# Altium project lora_carrier.PrjPcb
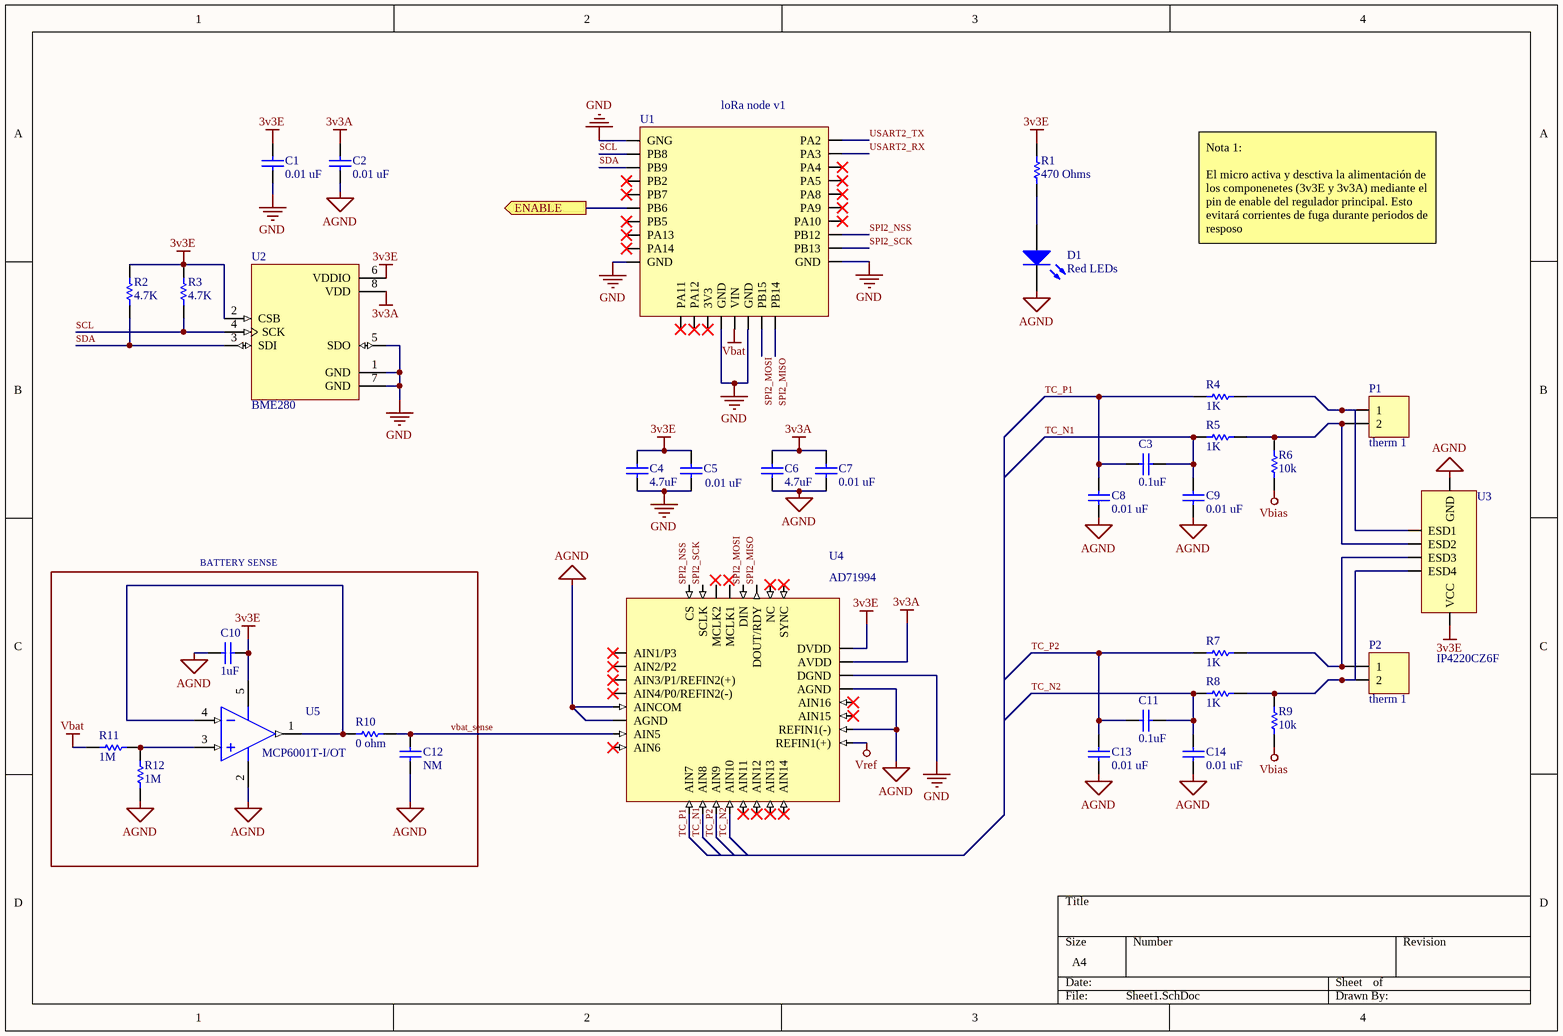
[diagram p0: Sheet1.SchDoc]
2 sheets, 50 parts. Net scope: flat (ports and power ports of the same name join across sheets).
Sheets:
  Sheet1.SchDoc
  supply.SchDoc

## Sheet Sheet1.SchDoc
size A4

### Parts
C1  0.01 uF
C2  0.01 uF
C3  0.1uF  [Chip2PinKEMETcap]
C4  4.7uF
C5  0.01 uF
C6  4.7uF
C7  0.01 uF
C8  0.01 uF
C9  0.01 uF
C10  1uF  [Chip2PinWURTcap]
C11  0.1uF  [Chip2PinKEMETcap]
C12  NM
C13  0.01 uF
C14  0.01 uF
D1  Red LEDs  [Wurth_LED_0603]
P1  therm 1  [HDR1X2]
P2  therm 1  [HDR1X2]
R1  470 Ohms
R2  4.7K
R3  4.7K
R4  1K
R5  1K
R6  10k
R7  1K
R8  1K
R9  10k
R10  0 ohm
R11  1M
R12  1M
U1  loRa node v1
U2  BME280
U3  IP4220CZ6F
U4  AD71994
U5  MCP6001T-I/OT

### Blocks framed on the sheet
BATTERY SENSE: C10 C12 R10-R12 U5

### Ports
ENABLE (out)

### Nets
3v3A: C2.1 C6.2 C7.1 U2.8(VDD) U4.23(AVDD)
3v3E: C1.1 C4.2 C5.1 C10.2 R1.1 R2.2 R3.2 U2.2(CSB) U2.6(VDDIO) U3.5(VCC) U4.24(DVDD) U5.5(V+)
AGND: C1.2 C2.2 C4.1 C5.2 C6.1 C7.2 C8.2 C9.1 C10.1 C12.2 C13.2 C14.1 D1.2(K) R12.1 U1.1(GNG) U1.10(GND) U1.14(GND) U1.16(GND) U1.19(GND) U2.1(GND) U2.5(SDO) U2.7(GND) U3.2(GND) U4.5(AINCOM) U4.6(AGND) U4.18(REFIN1(-)) U4.21(AGND) U4.22(DGND) U5.2(V-)  [also labelled GND]
Vbat: R11.1 U1.15(VIN)
Vbias: R6.2 R9.2
Vref: U4.17(REFIN1(+))
SCL: R3.1 U1.2(PB8) U2.4(SCK)
SDA: R2.1 U1.3(PB9) U2.3(SDI)
SPI2_MISO: U1.18(PB14) U4.27(DOUT/RDY)
SPI2_MOSI: U1.17(PB15) U4.28(DIN)
SPI2_NSS: U1.21(PB12) U4.32(CS)
SPI2_SCK: U1.20(PB13) U4.31(SCLK)
TC_N1: C3.2 C9.2 R5.1 U4.10(AIN8)
TC_N2: C11.2 C14.2 R8.1 U4.12(AIN10)
TC_P1: C3.1 C8.1 R4.1 U4.9(AIN7)
TC_P2: C11.1 C13.1 R7.1 U4.11(AIN9)
USART2_RX: U1.27(PA3)
USART2_TX: U1.28(PA2)
vbat_sense: C12.1 R10.2 U4.7(AIN5)
NetD1_1: D1.1(A) R1.2
NetP1_1: P1.1 R4.2 U3.1(ESD1)
NetP1_2: P1.2 R5.2 R6.1 U3.3(ESD2)
NetP2_1: P2.1 R7.2 U3.4(ESD3)
NetP2_2: P2.2 R8.2 R9.1 U3.6(ESD4)
NetR10_1: R10.1 U5.1(OUT) U5.4(IN-)
NetR11_2: R11.2 R12.2 U5.3(IN+)
NetU1_6: U1.6(PB6) ; port ENABLE

Not connected (* = marked no-connect by the designer): U1 4(PB2)* 5(PB7)* 7(PB5)* 8(PA13)* 9(PA14)* 11(PA11)* 12(PA12)* 13(3V3)* 22(PA10)* 23(PA9)* 24(PA8)* 25(PA5)* 26(PA4)*; U4 1(AIN1/P3)* 2(AIN2/P2)* 3(AIN3/P1/REFIN2(+))* 4(AIN4/P0/REFIN2(-))* 8(AIN6)* 13(AIN11)* 14(AIN12)* 15(AIN13)* 16(AIN14)* 19(AIN15)* 20(AIN16)* 25(SYNC)* 26(NC)* 29(MCLK1) 30(MCLK2)

### Notes on the sheet
- Nota 1:
  El micro activa y desctiva la alimentación de los componenetes (3v3E y 3v3A) mediante el pin de enable del regulador principal. Esto evitará corrientes de fuga durante periodos de resposo

### Library data of the parts
C1 C2 C5 C7-C9 C13 C14 = 885012206089: Multilayer Ceramic Capacitors MLCC - SMD/SMT WCAP-CSGP 0.01uF 0603 10% 50V MLCC; Manufacturer: Wurth Electronics; Voltage Rating DC: 50 VDC; Capacitance - nF: 10 nF; Capacitance - pF: 10000 pF; Dielectric: X7R; Supplier 1: Mouser; Manufacturer Part Number: 885012206089; RoHS: RoHS Compliant; Category: Multilayer Ceramic Capacitors MLCC - SMD/SMT; Stock 1: 174725; Pricing 1: 1=0.040, 10=0.032, 50=0.026, 100=0.021, 250=0.018, 500=0.017, 4000=0.017 (EUR); Capacitance: 0.01 uF; Height: 0.8 mm; Length: 1.6 mm; Package / Case: 0603 (1608 metric); Packaging: Cut Tape; Product: General Type MLCCs; Series: WCAP-CSGP; Termination Style: SMD/SMT; Tolerance: 10 %; Width: 0.8 mm; Brand: Wurth Electronics; Case Code - in: 0603; Case Code - mm: 1608; Maximum Operating Temperature: + 125 C; Minimum Operating Temperature: - 55 C; Product Type: Ceramic Capacitors; Standard Pack Qty: 4000; Subcategory: Capacitors; RoHS - Mouser: Y; Minimum Order Quantity: 1; Reeling: True; ComponentLink1URL: https://www.mouser.com/datasheet/2/445/885012206089-554597.pdf; ComponentLink1Description: https://www.mouser.com/datasheet/2/445/885012206089-554597.pdf; Supplier Part Number 1: 710-885012206089
C3 C11 = C0603C104J3RAC: Multilayer Ceramic Capacitors MLCC - SMD/SMT 25V 0.1uF 0603 X7R 0.05; Manufacturer: KEMET; Tolerance: 5 %; Voltage Rating DC: 25 VDC; Capacitance - nF: 100 nF; Capacitance - pF: 100000 pF; Class: Class 2; CNHTS: 8532241000; TARIC: 8532240000; Published: 8-Jun-2000; LatestRevisionDate: 17-Jul-2002; LatestRevisionNote: Re-released for DXP Platform.; PackageReference: RAD-0.3; Publisher: Altium Limited; PackageDescription: Radial Cap, Thru-Hole; 2 Leads; 0.3 in Pin Spacing; Supplier 1: Mouser; Supplier Part Number 1: 80-C0603C104J3RAC; Manufacturer Part Number: C0603C104J3RAC; RoHS: RoHS Compliant; Category: Multilayer Ceramic Capacitors MLCC - SMD/SMT; Stock 1: 3422; Pricing 1: 1=0.367, 10=0.213, 100=0.129, 500=0.117, 1000=0.106, 4000=0.079, 8000=0.072, 24000=0.069, 48000=0.061 (EUR); Capacitance: 0.1 uF; Height: 0.8 mm; Length: 1.6 mm; Package / Case: 0603 (1608 metric); Packaging: Cut Tape; Product: General Type MLCCs; Series: SMD Comm X7R; Termination Style: SMD/SMT; Voltage Rating AC: -; Width: 0.8 mm; Brand: KEMET; Case Code - in: 0603; Case Code - mm: 1608; Dielectric: X7R; HTS Code: 8532240020; Maximum Operating Temperature: + 125 C; Minimum Operating Temperature: - 55 C; Product Type: Ceramic Capacitors; Standard Pack Qty: 4000; Subcategory: Capacitors; Termination: Standard; RoHS - Mouser: Y; Minimum Order Quantity: 1; Reeling: True; ComponentLink1URL: http://www.mouser.com/datasheet/2/212/KEM_C1002_X7R_SMD-1102033.pdf; ComponentLink1Description: http://www.mouser.com/datasheet/2/212/KEM_C1002_X7R_SMD-1102033.pdf; Value: 0.1uF
C4 C6 = JMK107BJ475KA-T: Multilayer Ceramic Capacitors MLCC - SMD/SMT 4.7uF 6.3V X5R 0603+/-10% Gen Purp; Manufacturer: Taiyo Yuden; Tolerance: 10 %; Type: General Purpose; Voltage Rating DC: 6.3 VDC; Capacitance - nF: 4700 nF; Class: Class 2; Supplier 1: Mouser; Manufacturer Part Number: JMK107BJ475KA-T; RoHS: RoHS Compliant; Category: Multilayer Ceramic Capacitors MLCC - SMD/SMT; Stock 1: 0; Pricing 1: 1=0.114, 10=0.042, 100=0.029, 500=0.024, 1000=0.019, 4000=0.019, 8000=0.014, 12000=0.012 (EUR); Capacitance: 4.7 uF; Height: 0.8 mm; Length: 1.6 mm; Package / Case: 0603 (1608 metric); Packaging: Cut Tape; Product: General Type MLCCs; Series: M; Termination Style: SMD/SMT; Width: 0.8 mm; Brand: Taiyo Yuden; Case Code - in: 0603; Case Code - mm: 1608; Dielectric: X5R; Maximum Operating Temperature: + 85 C; Minimum Operating Temperature: - 55 C; Product Type: Ceramic Capacitors; Standard Pack Qty: 4000; Subcategory: Capacitors; Termination: Standard; RoHS - Mouser: Y; Minimum Order Quantity: 1; Reeling: True; ComponentLink1URL: https://www.mouser.com/datasheet/2/396/mlcc02_e-1307760.pdf; ComponentLink1Description: https://www.mouser.com/datasheet/2/396/mlcc02_e-1307760.pdf; Supplier Part Number 1: 963-JMK107BJ475KA-T
C10 = 885012206052: Ceramic Capacitors; Manufacturer: Wurth Electronics; Tolerance: 10 %; Voltage Rating DC: 16 VDC; Capacitance - nF: 1000 nF; CNHTS: 8532241000; Dielectric: X7R; TARIC: 8532240000; Published: 8-Jun-2000; LatestRevisionDate: 17-Jul-2002; LatestRevisionNote: Re-released for DXP Platform.; PackageReference: RAD-0.3; Publisher: Altium Limited; PackageDescription: Radial Cap, Thru-Hole; 2 Leads; 0.3 in Pin Spacing; Supplier 1: Mouser; Supplier Part Number 1: 710-885012206052; Manufacturer Part Number: 885012206052; RoHS: RoHS Compliant; Category: Multilayer Ceramic Capacitors MLCC - SMD/SMT; Stock 1: 27157; Pricing 1: 1=0.110, 10=0.104, 50=0.085, 100=0.067, 250=0.059, 500=0.054, 4000=0.054 (EUR); Capacitance: 1 uF; Height: 0.8 mm; Length: 1.6 mm; Package / Case: 0603 (1608 metric); Packaging: Cut Tape; Product: General Type MLCCs; Series: WCAP-CSGP; Termination Style: SMD/SMT; Width: 0.8 mm; Brand: Wurth Electronics; Case Code - in: 0603; Case Code - mm: 1608; HTS Code: 8532240020; Maximum Operating Temperature: + 125 C; Minimum Operating Temperature: - 55 C; Product Type: Ceramic Capacitors; Standard Pack Qty: 4000; Subcategory: Capacitors; RoHS - Mouser: Y; Minimum Order Quantity: 1; Reeling: True; ComponentLink1URL: http://www.mouser.com/datasheet/2/445/885012206052-554330.pdf; ComponentLink1Description: http://www.mouser.com/datasheet/2/445/885012206052-554330.pdf
C12 = 0603_CAP
D1 = 150060RS75000: Typical INFRARED GaAs LED; Manufacturer: Wurth Electronics; Lens Color/Style: Water Clear; Power Rating: 72 mW; Lens Shape: Rectangular; Luminous Intensity: 250 mcd; Peak Wavelength: 630 nm; Viewing Angle: 140 deg; CNHTS: 8541401000; If - Forward Current: 20 mA; MXHTS: 85414001; Vf - Forward Voltage: 2 V; Vr - Reverse Voltage: 5 V; Wavelength/Color Temperature: 625 nm; Published: 8-Jun-2000; LatestRevisionDate: 08-Jul-2005; LatestRevisionNote: Mech Layer 1 removed.; PackageReference: LED-0; Publisher: Altium Limited; PackageDescription: LED; 2 Leads; Supplier 1: Mouser; Supplier Part Number 1: 710-150060RS75000; Manufacturer Part Number: 150060RS75000; RoHS: RoHS Compliant; Category: Standard LEDs - SMD; Stock 1: 74254; Pricing 1: 1=0.130, 10=0.126, 50=0.115, 100=0.099, 500=0.085, 4000=0.085 (EUR); Height: 0.7 mm; Illumination Color: Red; Length: 1.6 mm; Package / Case: 0603 (1608 metric); Packaging: Cut Tape; Product: Red LEDs; Series: WL-SMCW; Width: 0.8 mm; Brand: Wurth Electronics; Mounting Style: SMD/SMT; HTS Code: 8541402000; Lens Dimensions: 1.1 mm x 0.8 mm; Maximum Operating Temperature: + 85 C; Minimum Operating Temperature: - 40 C; Product Type: LED - Standard; Standard Pack Qty: 4000; Subcategory: LEDs; TARIC: 8541401000; RoHS - Mouser: Y; Minimum Order Quantity: 1; Reeling: True; ComponentLink1URL: http://www.mouser.com/datasheet/2/445/150060RS75000-368563.pdf; ComponentLink1Description: http://www.mouser.com/datasheet/2/445/150060RS75000-368563.pdf
P1 P2 = Header 2: Header, 2-Pin; LatestRevisionDate: 17-Jul-2002; LatestRevisionNote: Re-released for DXP Platform.; Publisher: Altium Limited
R1 = AC0603FR-13470RL: Thick Film Resistors - SMD 470 ohm 1% 1/10W AEC-Q200; Manufacturer: Yageo; Power Rating: 100 mW (1/10 W); Temperature Coefficient: 100 PPM / C; Product Status: New Product; Supplier 1: Mouser; Manufacturer Part Number: AC0603FR-13470RL; RoHS: RoHS Compliant; Category: Thick Film Resistors - SMD; Stock 1: 35113; Pricing 1: 1=0.087, 10=0.019, 100=0.007, 1000=0.005, 2500=0.003, 20000=0.003 (EUR); Features: -; Height: 0.45 mm; Length: 1.6 mm; Package / Case: 0603 (1608 metric); Packaging: Cut Tape; Product: Thick Film Resistors General Purpose; Resistance: 470 Ohms; Series: AC; Technology: Thick Film; Termination Style: SMD/SMT; Tolerance: 1 %; Width: 0.8 mm; Brand: Yageo; Mounting Style: PCB Mount; Case Code - in: 0603; Case Code - mm: 1608; Maximum Operating Temperature: + 155 C; Minimum Operating Temperature: - 55 C; Product Type: Thick Film Resistors; Standard Pack Qty: 20000; Subcategory: Resistors; RoHS - Mouser: Y; Minimum Order Quantity: 1; Reeling: True; ComponentLink1URL: https://www.mouser.com/datasheet/2/447/PYu-AC_51_RoHS_L_6-1152827.pdf; ComponentLink1Description: https://www.mouser.com/datasheet/2/447/PYu-AC_51_RoHS_L_6-1152827.pdf; Supplier Part Number 1: 603-AC0603FR-13470RL
R2 R3 = RC0201JR-074K7L: Thick Film Resistors - SMD 4.7K OHM 5%; Manufacturer: Yageo; Power Rating: 50 mW (1/20 W); Resistance: 4.7 kOhms; Temperature Coefficient: 200 PPM / C; Voltage Rating: 25 V; Supplier 1: Mouser; Manufacturer Part Number: RC0201JR-074K7L; RoHS: RoHS Compliant; Category: Thick Film Resistors - SMD; Stock 1: 134718; Pricing 1: 1=0.087, 10=0.019, 100=0.007, 1000=0.005, 2500=0.003, 10000=0.003 (EUR); Application: High Reliability; Features: -; Height: 0.23 mm; Length: 0.6 mm; Package / Case: 0201 (0603 metric); Packaging: Cut Tape; Product: Thick Film Resistors SMD; Series: RC; Technology: Thick Film; Termination Style: SMD/SMT; Tolerance: 5 %; Type: General Purpose; Width: 0.3 mm; Brand: Yageo; Mounting Style: PCB Mount; Case Code - in: 0201; Case Code - mm: 0603; Maximum Operating Temperature: + 125 C; Minimum Operating Temperature: - 55 C; Product Type: Thick Film Resistors; Standard Pack Qty: 10000; Subcategory: Resistors; RoHS - Mouser: Y; Minimum Order Quantity: 1; Reeling: True; ComponentLink1URL: https://www.mouser.com/datasheet/2/447/PYu-RC_Group_51_RoHS_L_9-1314892.pdf; ComponentLink1Description: https://www.mouser.com/datasheet/2/447/PYu-RC_Group_51_RoHS_L_9-1314892.pdf; Supplier Part Number 1: 603-RC0201JR-074K7L
R4 R5 R7 R8 = CRCW06031K00FKEAC: Thick Film Resistors - SMD 1/10Watt 1Kohms 1% Commercial Use; Manufacturer: Vishay; Power Rating: 100 mW (1/10 W); Temperature Coefficient: 100 PPM / C; Voltage Rating: 75 V; Product Status: New Product; Supplier 1: Mouser; Manufacturer Part Number: CRCW06031K00FKEAC; RoHS: RoHS Compliant By Exemption; Category: Thick Film Resistors - SMD; Stock 1: 673640; Pricing 1: 1=0.087, 10=0.024, 100=0.010, 500=0.006, 1000=0.003, 5000=0.003 (EUR); Features: -; Height: 0.45 mm; Length: 1.55 mm; Package / Case: 0603 (1608 metric); Packaging: Cut Tape; Product: Thick Film Resistors SMD; Resistance: 1 kOhms; Series: CRCW-C e3; Technology: Thick Film; Termination Style: SMD/SMT; Tolerance: 1 %; Width: 0.85 mm; Brand: Vishay; Mounting Style: PCB Mount; Case Code - in: 0603; Case Code - mm: 1608; Maximum Operating Temperature: + 155 C; Minimum Operating Temperature: - 55 C; Product Type: Thick Film Resistors; Standard Pack Qty: 5000; Subcategory: Resistors; RoHS - Mouser: E; Minimum Order Quantity: 1; Reeling: True; ComponentLink1URL: https://www.mouser.com/datasheet/2/427/crcwce3-1223726.pdf; ComponentLink1Description: https://www.mouser.com/datasheet/2/427/crcwce3-1223726.pdf; Supplier Part Number 1: 71-CRCW06031K00FKEAC
R6 R9 = CRCW060310K0JNEBC: Thick Film Resistors - SMD 1/10Watt 10Kohms 5% Commercial Use; Manufacturer: Vishay; Power Rating: 100 mW (1/10 W); Temperature Coefficient: 200 PPM / C; Product Status: New Product; Supplier 1: Mouser; Manufacturer Part Number: CRCW060310K0JNEBC; RoHS: RoHS Compliant By Exemption; Category: Thick Film Resistors - SMD; Stock 1: 47476; Pricing 1: 1=0.087, 10=0.019, 100=0.008, 1000=0.003, 10000=0.003 (EUR); Features: -; Height: 0.45 mm; Length: 1.55 mm; Package / Case: 0603 (1608 metric); Packaging: Cut Tape; Product: Thick Film Resistors General Purpose; Resistance: 10 kOhms; Series: CRCW-C e3; Technology: Thick Film; Termination Style: SMD/SMT; Tolerance: 5 %; Width: 0.85 mm; Brand: Vishay; Mounting Style: PCB Mount; Case Code - in: 0603; Case Code - mm: 1608; Maximum Operating Temperature: + 155 C; Minimum Operating Temperature: - 55 C; Product Type: Thick Film Resistors; Standard Pack Qty: 10000; Subcategory: Resistors; RoHS - Mouser: E; Minimum Order Quantity: 1; Reeling: True; ComponentLink1URL: https://www.mouser.com/datasheet/2/427/crcwce3-1223726.pdf; ComponentLink1Description: https://www.mouser.com/datasheet/2/427/crcwce3-1223726.pdf; Supplier Part Number 1: 71-CRCW060310K0JNEBC
R10 = CRCW06030000Z0EAC: Thick Film Resistors - SMD 1/10Watt 0ohms Commercial Use; Manufacturer: Vishay; Power Rating: 100 mW (1/10 W); Voltage Rating: 75 V; Product Status: New Product; Supplier 1: Mouser; Manufacturer Part Number: CRCW06030000Z0EAC; RoHS: RoHS Compliant By Exemption; Category: Thick Film Resistors - SMD; Stock 1: 995828; Pricing 1: 1=0.087, 10=0.024, 100=0.010, 1000=0.004, 2000=0.003, 5000=0.003 (EUR); Features: -; Height: 0.45 mm; Length: 1.55 mm; Package / Case: 0603 (1608 metric); Packaging: Cut Tape; Product: Thick Film Resistors SMD; Resistance: 0 Ohms; Series: CRCW-C e3; Technology: Thick Film; Temperature Coefficient: -; Termination Style: SMD/SMT; Width: 0.85 mm; Brand: Vishay; Mounting Style: PCB Mount; Case Code - in: 0603; Case Code - mm: 1608; Maximum Operating Temperature: + 155 C; Minimum Operating Temperature: - 55 C; Product Type: Thick Film Resistors; Standard Pack Qty: 5000; Subcategory: Resistors; RoHS - Mouser: E; Minimum Order Quantity: 1; Reeling: True; ComponentLink1URL: https://www.mouser.com/datasheet/2/427/crcwce3-1223726.pdf; ComponentLink1Description: https://www.mouser.com/datasheet/2/427/crcwce3-1223726.pdf; Supplier Part Number 1: 71-CRCW06030000Z0EAC
R11 R12 = RC0603FR-071ML: Thick Film Resistors - SMD 1M OHM 1%; Manufacturer: Yageo; Power Rating: 100 mW, 200 mW; Resistance: 1 MOhms; Temperature Coefficient: 100 PPM / C; Voltage Rating: 75 V; Supplier 1: Mouser; Manufacturer Part Number: RC0603FR-071ML; RoHS: RoHS Compliant; Category: Thick Film Resistors - SMD; Stock 1: 5552342; Pricing 1: 1=0.087, 10=0.016, 100=0.005, 1000=0.004, 5000=0.003, 50000=0.002 (EUR); Application: High Reliability; Features: -; Height: 0.45 mm; Length: 1.6 mm; Package / Case: 0603 (1608 metric); Packaging: Cut Tape; Product: Thick Film Resistors SMD; Series: RC; Technology: Thick Film; Termination Style: SMD/SMT; Tolerance: 1 %; Type: General Purpose; Width: 0.8 mm; Brand: Yageo; Mounting Style: PCB Mount; Case Code - in: 0603; Case Code - mm: 1608; Maximum Operating Temperature: + 155 C; Minimum Operating Temperature: - 55 C; Product Type: Thick Film Resistors; Standard Pack Qty: 5000; Subcategory: Resistors; RoHS - Mouser: Y; Minimum Order Quantity: 1; Reeling: True; ComponentLink1URL: https://www.mouser.com/datasheet/2/447/PYu-RC_Group_51_RoHS_L_9-1314892.pdf; ComponentLink1Description: https://www.mouser.com/datasheet/2/447/PYu-RC_Group_51_RoHS_L_9-1314892.pdf; Supplier Part Number 1: 603-RC0603FR-071ML
U1 = node_v1
U2 = BME280: Board Mount Humidity Sensors; Manufacturer: Bosch Sensortec; Output Type: Digital; Interface Type: I2C, SPI; Operating Supply Current: 0.5 uA; Operating Supply Voltage: 1.8 V; RH Accuracy: 3 %; RH Range: 0 % to 100 %; Supply Voltage - Max: 3.6 V; Supply Voltage - Min: 1.7 V; Supplier 1: Mouser; Manufacturer Part Number: BME280; RoHS: RoHS Compliant; Category: Board Mount Humidity Sensors; Stock 1: 12614; Pricing 1: 1=5.78, 10=5.20, 25=4.63, 50=4.28, 100=3.70, 500=3.47, 1000=3.24, 5000=2.96, 10000=2.68 (EUR); Package / Case: LGA-8; Packaging: Cut Tape; Product: Board Mount; Brand: Bosch Sensortec; Mounting Style: SMD/SMT; Maximum Operating Temperature: + 85 C; Minimum Operating Temperature: - 40 C; Product Type: Humidity Sensors; Standard Pack Qty: 10000; Subcategory: Sensors; RoHS - Mouser: Y; Minimum Order Quantity: 1; Reeling: True; Supplier Part Number 1: 262-BME280
U3 = IP4220CZ6F: ESD Suppressors / TVS Diodes IP4220CZ6/SC-74/REEL 13" Q1/T1; Manufacturer: Nexperia; Supplier 1: Mouser; Manufacturer Part Number: IP4220CZ6F; RoHS: RoHS Compliant; Category: ESD Suppressors / TVS Diodes; Stock 1: 23187; Pricing 1: 1=0.349, 10=0.272, 100=0.147, 1000=0.110, 2500=0.095, 10000=0.089, 20000=0.082, 50000=0.079 (EUR); Packaging: Cut Tape; Brand: Nexperia; Product Type: TVS Diodes; Standard Pack Qty: 10000; Subcategory: TVS Diodes / ESD Suppression Diodes; RoHS - Mouser: Y; Minimum Order Quantity: 1; Reeling: True; Supplier Part Number 1: 771-IP4220CZ6F
U4 = AD7194BCPZ: Analog to Digital Converters - ADC 8CH Ultra Low Noise 24Bit w/ PGA; Manufacturer: Analog Devices; Input Type: Differential/Pseudo-Differential; Input Voltage: +/- 2.5 V; Number of Converters: 1 Converter; Sampling Rate: 4.8 kS/s; Architecture: Sigma-Delta; Interface Type: Serial, 3-Wire, SPI; Number of Channels: 8 Channel; Reference Type: External; Development Kit: EVAL-AD7194EBZ; Gain Error: +/- 0.005 %FSR; INL - Integral Nonlinearity: +/- 30 ppm of FSR; Number of ADC Inputs: 16 Input/8 Input; Operating Supply Voltage: 3.3 V, 5 V; Pd - Power Dissipation: 29 mW; Sample and Hold: No; Supplier 1: Mouser; Manufacturer Part Number: AD7194BCPZ; RoHS: RoHS Compliant; Category: Analog to Digital Converters - ADC; Stock 1: 878; Pricing 1: 1=13.48, 10=12.23, 25=11.49, 50=11.06, 100=9.96, 250=9.20, 500=8.65, 1000=8.35 (EUR); Height: 0.73 mm; Length: 5 mm; Package / Case: LFCSP-32; Packaging: Tray; Product: Analog to Digital Converters; Resolution: 24 bit; Series: AD7194; Width: 5 mm; Brand: Analog Devices; Mounting Style: SMD/SMT; Maximum Operating Temperature: + 105 C; Minimum Operating Temperature: - 40 C; Product Type: ADCs - Analog to Digital Converters; Standard Pack Qty: 490; Subcategory: Data Converter ICs; RoHS - Mouser: Y; Minimum Order Quantity: 1; Reeling: False; ComponentLink1URL: https://www.mouser.com/datasheet/2/609/AD7194-1501808.pdf; ComponentLink1Description: https://www.mouser.com/datasheet/2/609/AD7194-1501808.pdf; Supplier Part Number 1: 584-AD7194BCPZ
U5 = MCP6001T-I/OT: Operational Amplifiers - Op Amps Single 1.8V 1MHz; Manufacturer: Microchip Technology; Amplifier Type: Low Power Amplifier; Number of Channels: 1 Channel; Shutdown: No Shutdown; CMRR - Common Mode Rejection Ratio: 60 dB; en - Input Voltage Noise Density: 28 nV/sqrt Hz; Ib - Input Bias Current: 1 pA; In - Input Noise Current Density: 0.0006 pA/sqrt Hz; Operating Supply Current: 100 uA; Operating Supply Voltage: 1.8 V to 5.5 V; Output Current per Channel: 23 mA; PSRR - Power Supply Rejection Ratio: 86 dB; SR - Slew Rate: 0.6 V/us; Supply Voltage - Max: 5.5 V; Voltage Gain dB: 112 dB; Vos - Input Offset Voltage: 4.5 mV; Supplier 1: Mouser; Manufacturer Part Number: MCP6001T-I/OT; RoHS: RoHS Compliant; Category: Operational Amplifiers - Op Amps; Stock 1: 73026; Pricing 1: 1=0.210, 25=0.180, 100=0.162, 3000=0.162 (EUR); Height: 1.3 mm (Max); Length: 3.1 mm (Max); Package / Case: SOT-23-5; Packaging: Cut Tape; Product: Operational Amplifiers; Supply Type: Single; Technology: CMOS; Width: 1.8 mm (Max); Brand: Microchip Technology; Mounting Style: SMD/SMT; GBP - Gain Bandwidth Product: 1 MHz; Maximum Operating Temperature: + 85 C; Minimum Operating Temperature: - 40 C; Product Type: Op Amps - Operational Amplifiers; Standard Pack Qty: 3000; Subcategory: Amplifier ICs; Supply Voltage - Min: 1.8 V; RoHS - Mouser: Y; Minimum Order Quantity: 1; Reeling: True; ComponentLink1URL: https://www.mouser.com/datasheet/2/268/21733e-41017.pdf; ComponentLink1Description: https://www.mouser.com/datasheet/2/268/21733e-41017.pdf; Supplier Part Number 1: 579-MCP6001T-I/OT

## Sheet supply.SchDoc
size A4
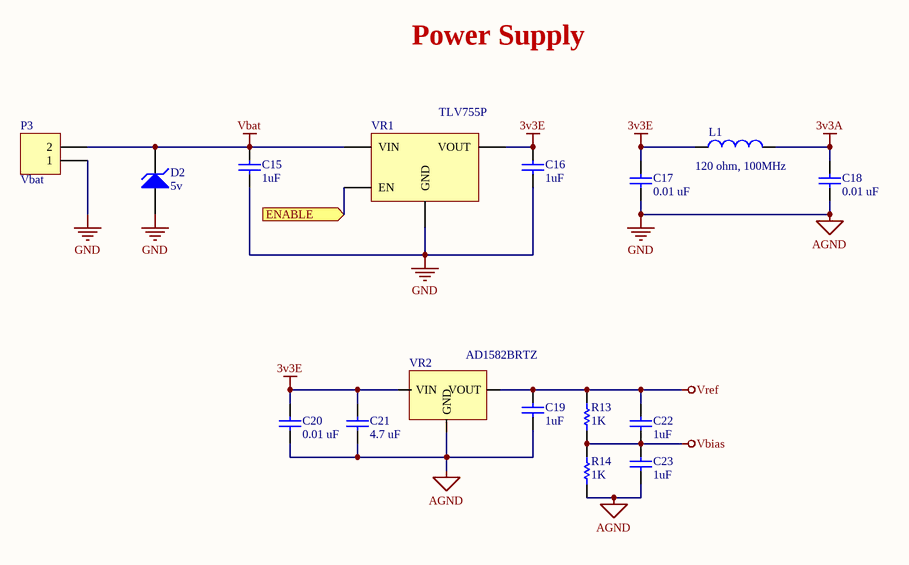
[diagram p1: supply.SchDoc]

### Parts
C15  1uF  [Chip2PinWURTcap]
C16  1uF  [Chip2PinWURTcap]
C17  0.01 uF
C18  0.01 uF
C19  1uF  [Chip2PinWURTcap]
C20  0.01 uF
C21  4.7 uF
C22  1uF  [Chip2PinWURTcap]
C23  1uF  [Chip2PinWURTcap]
D2  5v
L1  120 ohm, 100MHz
P3  Vbat  [HDR1X2]
R13  1K
R14  1K
VR1  TLV755P  [SOT23-TLV755P]
VR2  AD1582BRTZ

### Ports
ENABLE (in)

### Nets
3v3A: C18.1 L1.2
3v3E: C16.1 C17.1 C20.2 C21.2 L1.1 VR1.5(VOUT) VR2.3(VIN)
AGND: C15.2 C16.2 C17.2 C18.2 C19.1 C20.1 C21.1 C23.1 D2.1(A) P3.1 R14.2 VR1.2(GND) VR2.2(GND)  [also labelled GND]
Vbat: C15.1 D2.3(K) P3.2 VR1.1(VIN)
Vbias: C22.1 C23.2 R13.2 R14.1
Vref: C19.2 C22.2 R13.1 VR2.1(VOUT)
NetU1_6: VR1.3(EN) ; port ENABLE

### Notes on the sheet
- Power Supply

### Library data of the parts
C15 C16 C19 C22 C23 = 885012206052: as C10 on sheet Sheet1; Published: 8-Jun-2000; LatestRevisionDate: 17-Jul-2002; LatestRevisionNote: Re-released for DXP Platform.; PackageReference: RAD-0.3; Publisher: Altium Limited; PackageDescription: Radial Cap, Thru-Hole; 2 Leads; 0.3 in Pin Spacing; Supplier 1: Mouser; Supplier Part Number 1: 710-885012206052; Manufacturer Part Number: 885012206052; RoHS: RoHS Compliant; Category: Multilayer Ceramic Capacitors MLCC - SMD/SMT; Stock 1: 27157; Pricing 1: 1=0.110, 10=0.104, 50=0.085, 100=0.067, 250=0.059, 500=0.054, 4000=0.054 (EUR); Capacitance: 1 uF; Height: 0.8 mm; Length: 1.6 mm; Package / Case: 0603 (1608 metric); Packaging: Cut Tape; Product: General Type MLCCs; Series: WCAP-CSGP; Termination Style: SMD/SMT; Width: 0.8 mm; Brand: Wurth Electronics; Case Code - in: 0603; Case Code - mm: 1608; HTS Code: 8532240020; Maximum Operating Temperature: + 125 C; Minimum Operating Temperature: - 55 C; Product Type: Ceramic Capacitors; Standard Pack Qty: 4000; Subcategory: Capacitors; RoHS - Mouser: Y; Minimum Order Quantity: 1; Reeling: True; ComponentLink1URL: http://www.mouser.com/datasheet/2/445/885012206052-554330.pdf; ComponentLink1Description: http://www.mouser.com/datasheet/2/445/885012206052-554330.pdf; Value: 1uF
C17 C18 C20 = 885012206089: as C1 on sheet Sheet1; Supplier 1: Mouser; Manufacturer Part Number: 885012206089; RoHS: RoHS Compliant; Category: Multilayer Ceramic Capacitors MLCC - SMD/SMT; Stock 1: 174725; Pricing 1: 1=0.040, 10=0.032, 50=0.026, 100=0.021, 250=0.018, 500=0.017, 4000=0.017 (EUR); Capacitance: 0.01 uF; Height: 0.8 mm; Length: 1.6 mm; Package / Case: 0603 (1608 metric); Packaging: Cut Tape; Product: General Type MLCCs; Series: WCAP-CSGP; Termination Style: SMD/SMT; Tolerance: 10 %; Width: 0.8 mm; Brand: Wurth Electronics; Case Code - in: 0603; Case Code - mm: 1608; Maximum Operating Temperature: + 125 C; Minimum Operating Temperature: - 55 C; Product Type: Ceramic Capacitors; Standard Pack Qty: 4000; Subcategory: Capacitors; RoHS - Mouser: Y; Minimum Order Quantity: 1; Reeling: True; ComponentLink1URL: https://www.mouser.com/datasheet/2/445/885012206089-554597.pdf; ComponentLink1Description: https://www.mouser.com/datasheet/2/445/885012206089-554597.pdf; Supplier Part Number 1: 710-885012206089
C21 = 06036D475KAT2A: Multilayer Ceramic Capacitors MLCC - SMD/SMT FACTORY NOT ACCEPTING ORDERS; Manufacturer: AVX; Tolerance: 10 %; Type: Commercial Surface Mount Chip; Voltage Rating DC: 6.3 VDC; Capacitance - nF: 4700 nF; Class: Class 2; Dielectric: X5R; Supplier 1: Mouser; Manufacturer Part Number: 06036D475KAT2A; RoHS: RoHS Compliant By Exemption; Category: Multilayer Ceramic Capacitors MLCC - SMD/SMT; Stock 1: 7820; Pricing 1: 1=0.306, 10=0.216, 100=0.122, 500=0.086, 1000=0.075, 2000=0.063, 4000=0.059, 8000=0.056, 24000=0.050 (EUR); Capacitance: 4.7 uF; Height: 0.9 mm; Length: 1.6 mm; Package / Case: 0603 (1608 metric); Packaging: Reel; Product: General Type MLCCs; Series: X5R; Termination Style: SMD/SMT; Width: 0.81 mm; Brand: AVX; Case Code - in: 0603; Case Code - mm: 1608; Maximum Operating Temperature: + 85 C; Minimum Operating Temperature: - 55 C; Product Type: Ceramic Capacitors; Standard Pack Qty: 4000; Subcategory: Capacitors; RoHS - Mouser: E; Minimum Order Quantity: 8000; Reeling: True; ComponentLink1URL: https://www.mouser.com/datasheet/2/40/cx5r-776519.pdf; ComponentLink1Description: https://www.mouser.com/datasheet/2/40/cx5r-776519.pdf; Supplier Part Number 1: 581-06036D475K
D2 = BZX84B5V1LFHT116: Zener Diodes 5-5.2V 5mA SOT-23; SOT-23; Manufacturer: ROHM Semiconductor; Configuration: Single; Ir - Reverse Current: 2 uA; Pd - Power Dissipation: 250 mW; Voltage Temperature Coefficient: 2.6 mV/C; Zz - Zener Impedance: 60 Ohms; Product Status: New Product; Supplier 1: Mouser; Manufacturer Part Number: BZX84B5V1LFHT116; RoHS: RoHS Compliant; Category: Zener Diodes; Stock 1: 5913; Pricing 1: 1=0.192, 10=0.133, 100=0.055, 1000=0.038, 3000=0.030 (EUR); Height: 0.95 mm; Length: 2.9 mm; Package / Case: SOT-23-3; Packaging: Cut Tape; Width: 1.3 mm; Brand: ROHM Semiconductor; Mounting Style: SMD/SMT; Zener Current: 5 mA; Maximum Operating Temperature: + 150 C; Minimum Operating Temperature: - 65 C; Product Type: Zener Diodes; Standard Pack Qty: 3000; Subcategory: Diodes & Rectifiers; Vz - Zener Voltage: 5 V; RoHS - Mouser: Y; Minimum Order Quantity: 1; Reeling: True; ComponentLink1URL: https://www.mouser.com/datasheet/2/348/bzx84b5v1lfht116-e-1507876.pdf; ComponentLink1Description: https://www.mouser.com/datasheet/2/348/bzx84b5v1lfht116-e-1507876.pdf; Supplier Part Number 1: 755-BZX84B5V1LFHT116
L1 = 2506031217Z0: Ferrite Beads MULTILAYER CHIP BEAD Z=120 OHM@100MHz 25%; Manufacturer: Fair-Rite; Impedance: 120 Ohms; Maximum DC Current: 450 mA; Maximum DC Resistance: 300 mOhms; Type: Multilayer Ferrite Chip Bead; Supplier 1: Mouser; Manufacturer Part Number: 2506031217Z0; RoHS: RoHS Compliant; Category: Ferrite Beads; Stock 1: 9619; Pricing 1: 1=0.032, 2500=0.027, 4000=0.025, 8000=0.024, 24000=0.022, 48000=0.021, 100000=0.018, 400000=0.016 (EUR); Capacitance: -; Height: 0.8 mm; Length: 1.6 mm; Operating Temperature Range: - 55 C to + 125 C; Package / Case: 0603 (1608 metric); Packaging: Cut Tape; Product: Ferrite Chip Beads; Termination Style: SMD/SMT; Tolerance: 25 %; Width: 0.8 mm; Brand: Fair-Rite; Maximum Operating Temperature: + 125 C; Minimum Operating Temperature: - 55 C; Product Type: Ferrite Beads; Standard Pack Qty: 4000; Subcategory: Ferrites; Termination: -; Test Frequency: 100 MHz; RoHS - Mouser: Y; Minimum Order Quantity: 1; Reeling: True; ComponentLink1URL: https://www.mouser.com/datasheet/2/150/2506031217Z0-471794.pdf; ComponentLink1Description: https://www.mouser.com/datasheet/2/150/2506031217Z0-471794.pdf; Supplier Part Number 1: 623-2506031217Z0
P3 = Header 2: Header, 2-Pin; LatestRevisionDate: 17-Jul-2002; LatestRevisionNote: Re-released for DXP Platform.; Publisher: Altium Limited
R13 R14 = CRCW06031K00FKEAC: as R4 on sheet Sheet1; Supplier 1: Mouser; Manufacturer Part Number: CRCW06031K00FKEAC; RoHS: RoHS Compliant By Exemption; Category: Thick Film Resistors - SMD; Stock 1: 673640; Pricing 1: 1=0.087, 10=0.024, 100=0.010, 500=0.006, 1000=0.003, 5000=0.003 (EUR); Features: -; Height: 0.45 mm; Length: 1.55 mm; Package / Case: 0603 (1608 metric); Packaging: Cut Tape; Product: Thick Film Resistors SMD; Resistance: 1 kOhms; Series: CRCW-C e3; Technology: Thick Film; Termination Style: SMD/SMT; Tolerance: 1 %; Width: 0.85 mm; Brand: Vishay; Mounting Style: PCB Mount; Case Code - in: 0603; Case Code - mm: 1608; Maximum Operating Temperature: + 155 C; Minimum Operating Temperature: - 55 C; Product Type: Thick Film Resistors; Standard Pack Qty: 5000; Subcategory: Resistors; RoHS - Mouser: E; Minimum Order Quantity: 1; Reeling: True; ComponentLink1URL: https://www.mouser.com/datasheet/2/427/crcwce3-1223726.pdf; ComponentLink1Description: https://www.mouser.com/datasheet/2/427/crcwce3-1223726.pdf; Supplier Part Number 1: 71-CRCW06031K00FKEAC
VR1 = TLV75533PDBVR: LDO Voltage Regulators 500-mA, Low IQ, Small Size, Low Dropout Regulator 5-SOT-23 -40 to 125; Manufacturer: Texas Instruments; Input Voltage MAX: 5.5 V; Number of Outputs: 1 Output; Output Current: 500 mA; Output Type: Fixed; Output Voltage: 3.3 V; Quiescent Current: 25 uA; Dropout Voltage - Max: 215 mV; PSRR / Ripple Rejection - Typ: 46 dB; Voltage Regulation Accuracy: 1.5 %; CNHTS: 8542319000; Dropout Voltage: 220 mV; Input Voltage MIN: 1.45 V; Line Regulation: 2 mV; Load Regulation: 0.06 V/A; Polarity: Positive; Product Status: New Product; Supplier 1: Mouser; Manufacturer Part Number: TLV75533PDBVR; RoHS: RoHS Compliant; Category: LDO Voltage Regulators; Stock 1: 48621; Pricing 1: 1=0.541, 10=0.454, 100=0.292, 1000=0.234, 2000=0.212, 3000=0.197, 9000=0.190 (EUR); Operating Temperature Range: - 40 C to + 125 C; Package / Case: SOT-23-5; Packaging: Cut Tape; Product: LDO Voltage Regulators; Series: TLV755P; Type: Low Quiescent Current, Ultra Small; Brand: Texas Instruments; Mounting Style: SMD/SMT; Output Voltage Range: -; HTS Code: 8542390001; Maximum Operating Temperature: + 125 C; Minimum Operating Temperature: - 40 C; Product Type: LDO Voltage Regulators; Standard Pack Qty: 3000; Subcategory: PMIC - Power Management ICs; RoHS - Mouser: Y; Minimum Order Quantity: 1; Reeling: True; Supplier Part Number 1: 595-TLV75533PDBVR
VR2 = AD1582BRTZ-REEL7: Voltage References 2.5V MICROPOWER REF IC; Manufacturer: Analog Devices; Accuracy: 3.5 mV/mA; Description/Function: 2.5 V micropower, precision series mode voltage reference; Input Voltage: 2.7 V to 12 V; Output Current: 5 mA; Temperature Coefficient: 50 PPM/C; Reference Type: Series Precision References; Topology: Series References; Operating Supply Current: 70 uA; Supplier 1: Mouser; Manufacturer Part Number: AD1582BRTZ-REEL7; RoHS: RoHS Compliant; Category: Voltage References; Stock 1: 7339; Pricing 1: 1=1.97, 10=1.79, 25=1.60, 100=1.46, 250=1.31, 500=1.14, 1000=0.952, 3000=0.919 (EUR); Height: 1.02 mm (Max); Length: 2.9 mm; Output Voltage: 2.5 V; Package / Case: SOT-23-3; Packaging: Cut Tape; Product: Voltage References; Series: AD1582; Width: 1.3 mm; Brand: Analog Devices; Mounting Style: SMD/SMT; Shunt Current - Max: 5 mA; Load Regulation: 3.5 mV/mA; Maximum Operating Temperature: + 125 C; Minimum Operating Temperature: - 40 C; Product Type: Voltage References; Standard Pack Qty: 3000; Subcategory: PMIC - Power Management ICs; RoHS - Mouser: Y; Minimum Order Quantity: 1; Reeling: True; ComponentLink1URL: https://www.mouser.com/datasheet/2/609/AD1582_1583_1584_1585-876960.pdf; ComponentLink1Description: https://www.mouser.com/datasheet/2/609/AD1582_1583_1584_1585-876960.pdf; Supplier Part Number 1: 584-AD1582BRTZ-R7

## Nets that join several sheets
3v3A: Sheet1 (5 pins), supply (C18.1 L1.2)
3v3E: Sheet1 (12 pins), supply (7 pins)
AGND: Sheet1 (29 pins), supply (13 pins)
Vbat: Sheet1 (R11.1 U1.15), supply (C15.1 D2.3 P3.2 VR1.1)
Vbias: Sheet1 (R6.2 R9.2), supply (C22.1 C23.2 R13.2 R14.1)
Vref: Sheet1 (U4.17), supply (C19.2 C22.2 R13.1 VR2.1)
NetU1_6: Sheet1 (U1.6), supply (VR1.3)